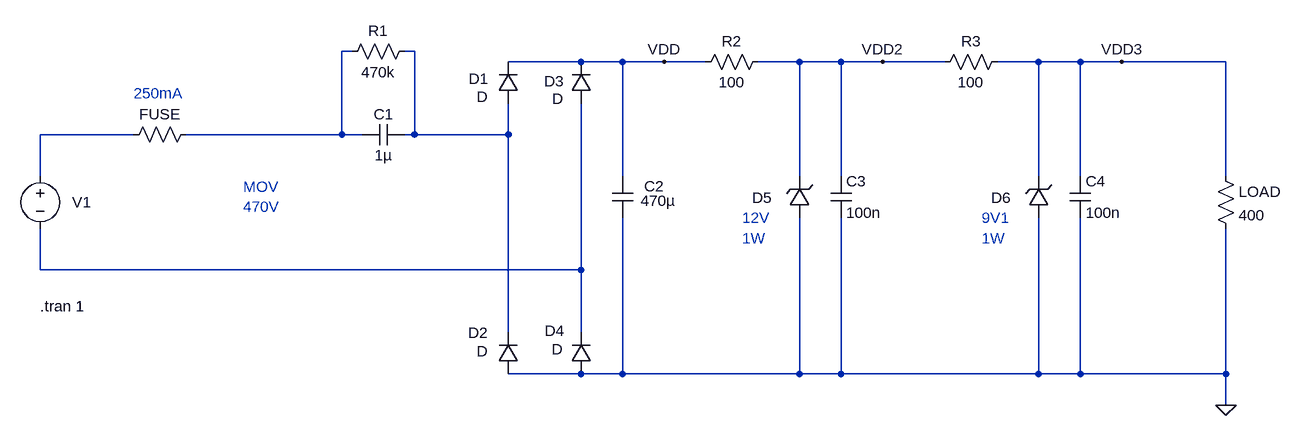
[diagram p0: schematic v1.1.asc]
v1.1.asc, the LTspice schematic file:
Version 4.1
SHEET 1 1748 680
WIRE 224 -64 208 -64
WIRE 320 -64 304 -64
WIRE 576 -48 464 -48
WIRE 640 -48 576 -48
WIRE 704 -48 640 -48
WIRE 768 -48 704 -48
WIRE 912 -48 848 -48
WIRE 976 -48 912 -48
WIRE 1040 -48 976 -48
WIRE 1136 -48 1040 -48
WIRE 1280 -48 1216 -48
WIRE 1344 -48 1280 -48
WIRE 1408 -48 1344 -48
WIRE 1568 -48 1408 -48
WIRE -112 64 -256 64
WIRE 208 64 208 -64
WIRE 208 64 -32 64
WIRE 240 64 208 64
WIRE 320 64 320 -64
WIRE 320 64 304 64
WIRE 464 64 464 16
WIRE 464 64 320 64
WIRE -256 128 -256 64
WIRE 640 128 640 -48
WIRE 912 128 912 -48
WIRE 976 128 976 -48
WIRE 1280 128 1280 -48
WIRE 1344 128 1344 -48
WIRE 1568 128 1568 -48
WIRE -256 272 -256 208
WIRE 576 272 576 16
WIRE 576 272 -256 272
WIRE 464 368 464 64
WIRE 576 368 576 272
WIRE 576 432 464 432
WIRE 640 432 640 192
WIRE 640 432 576 432
WIRE 912 432 912 192
WIRE 912 432 640 432
WIRE 976 432 976 192
WIRE 976 432 912 432
WIRE 1280 432 1280 192
WIRE 1280 432 976 432
WIRE 1344 432 1344 192
WIRE 1344 432 1280 432
WIRE 1568 432 1568 208
WIRE 1568 432 1344 432
WIRE 1568 480 1568 432
FLAG 1568 480 0
FLAG 1040 -48 VDD2
FLAG 704 -48 VDD
FLAG 1408 -48 VDD3
SYMBOL voltage -256 112 R0
WINDOW 0 49 56 Left 2
WINDOW 3 53 80 Invisible 2
WINDOW 123 0 0 Left 0
WINDOW 39 0 0 Left 0
SYMATTR InstName V1
SYMATTR Value SINE(0 310 50)
SYMBOL cap 240 80 R270
WINDOW 0 32 32 VTop 2
WINDOW 3 0 32 VBottom 2
SYMATTR InstName C1
SYMATTR Value 1µ
SYMATTR SpiceLine V=400
SYMBOL res 208 -48 R270
WINDOW 0 32 56 VTop 2
WINDOW 3 0 56 VBottom 2
SYMATTR InstName R1
SYMATTR Value 470k
SYMBOL diode 480 16 R180
WINDOW 0 46 38 Left 2
WINDOW 3 47 10 Left 2
SYMATTR InstName D1
SYMBOL diode 480 432 R180
WINDOW 0 47 63 Left 2
WINDOW 3 47 35 Left 2
SYMATTR InstName D2
SYMBOL diode 592 16 R180
WINDOW 0 42 34 Left 2
WINDOW 3 43 7 Left 2
SYMATTR InstName D3
SYMBOL diode 592 432 R180
WINDOW 0 41 66 Left 2
WINDOW 3 44 38 Left 2
SYMATTR InstName D4
SYMBOL cap 624 128 R0
WINDOW 0 49 15 Left 2
WINDOW 3 44 38 Left 2
SYMATTR InstName C2
SYMATTR Value 470µ
SYMATTR SpiceLine V=35
SYMBOL zener 928 192 R180
WINDOW 0 58 31 Left 2
WINDOW 3 42 16 Invisible 2
SYMATTR InstName D5
SYMATTR Value BZX84C12L
SYMBOL res 1552 112 R0
SYMATTR InstName LOAD
SYMATTR Value 400
SYMBOL res 752 -32 R270
WINDOW 0 32 56 VTop 2
WINDOW 3 0 56 VBottom 2
SYMATTR InstName R2
SYMATTR Value 100
SYMATTR SpiceLine pwr=1
SYMBOL res -128 80 R270
WINDOW 0 32 56 VTop 2
WINDOW 3 0 56 Invisible 2
SYMATTR InstName FUSE
SYMATTR Value 0.1
SYMBOL cap 960 128 R0
SYMATTR InstName C3
SYMATTR Value 100n
SYMBOL zener 1296 192 R180
WINDOW 0 58 31 Left 2
WINDOW 3 42 16 Invisible 2
SYMATTR InstName D6
SYMATTR Value BZX84B9V1LY
SYMBOL res 1120 -32 R270
WINDOW 0 32 56 VTop 2
WINDOW 3 0 56 VBottom 2
SYMATTR InstName R3
SYMATTR Value 100
SYMATTR SpiceLine pwr=1
SYMBOL cap 1328 128 R0
SYMATTR InstName C4
SYMATTR Value 100n
TEXT -256 328 Left 2 !.tran 1
TEXT -112 0 Left 2 ;250mA
TEXT 824 192 Left 2 ;12V\n1W
TEXT 56 144 Left 2 ;MOV\n470V
TEXT 1192 192 Left 2 ;9V1\n1W

The netlist it stands for:
* v1.1.asc
V1 N003 N004 SINE(0 310 50)
C1 N001 N002 1µ V=400
R1 N001 N002 470k
D1 N002 VDD D
D2 0 N002 D
D3 N004 VDD D
D4 0 N004 D
C2 VDD 0 470µ V=35
D5 0 VDD2 BZX84C12L
R§LOAD VDD3 0 400
R2 VDD VDD2 100 pwr=1
R§FUSE N003 N001 0.1
C3 VDD2 0 100n
D6 0 VDD3 BZX84B9V1LY
R3 VDD2 VDD3 100 pwr=1
C4 VDD3 0 100n
.model D D
.lib standard.dio
.tran 1
* 250mA
* 12V
* 1W
* MOV
* 470V
* 9V1
* 1W
.backanno
.end